# Altium project transmitter.PrjPcb
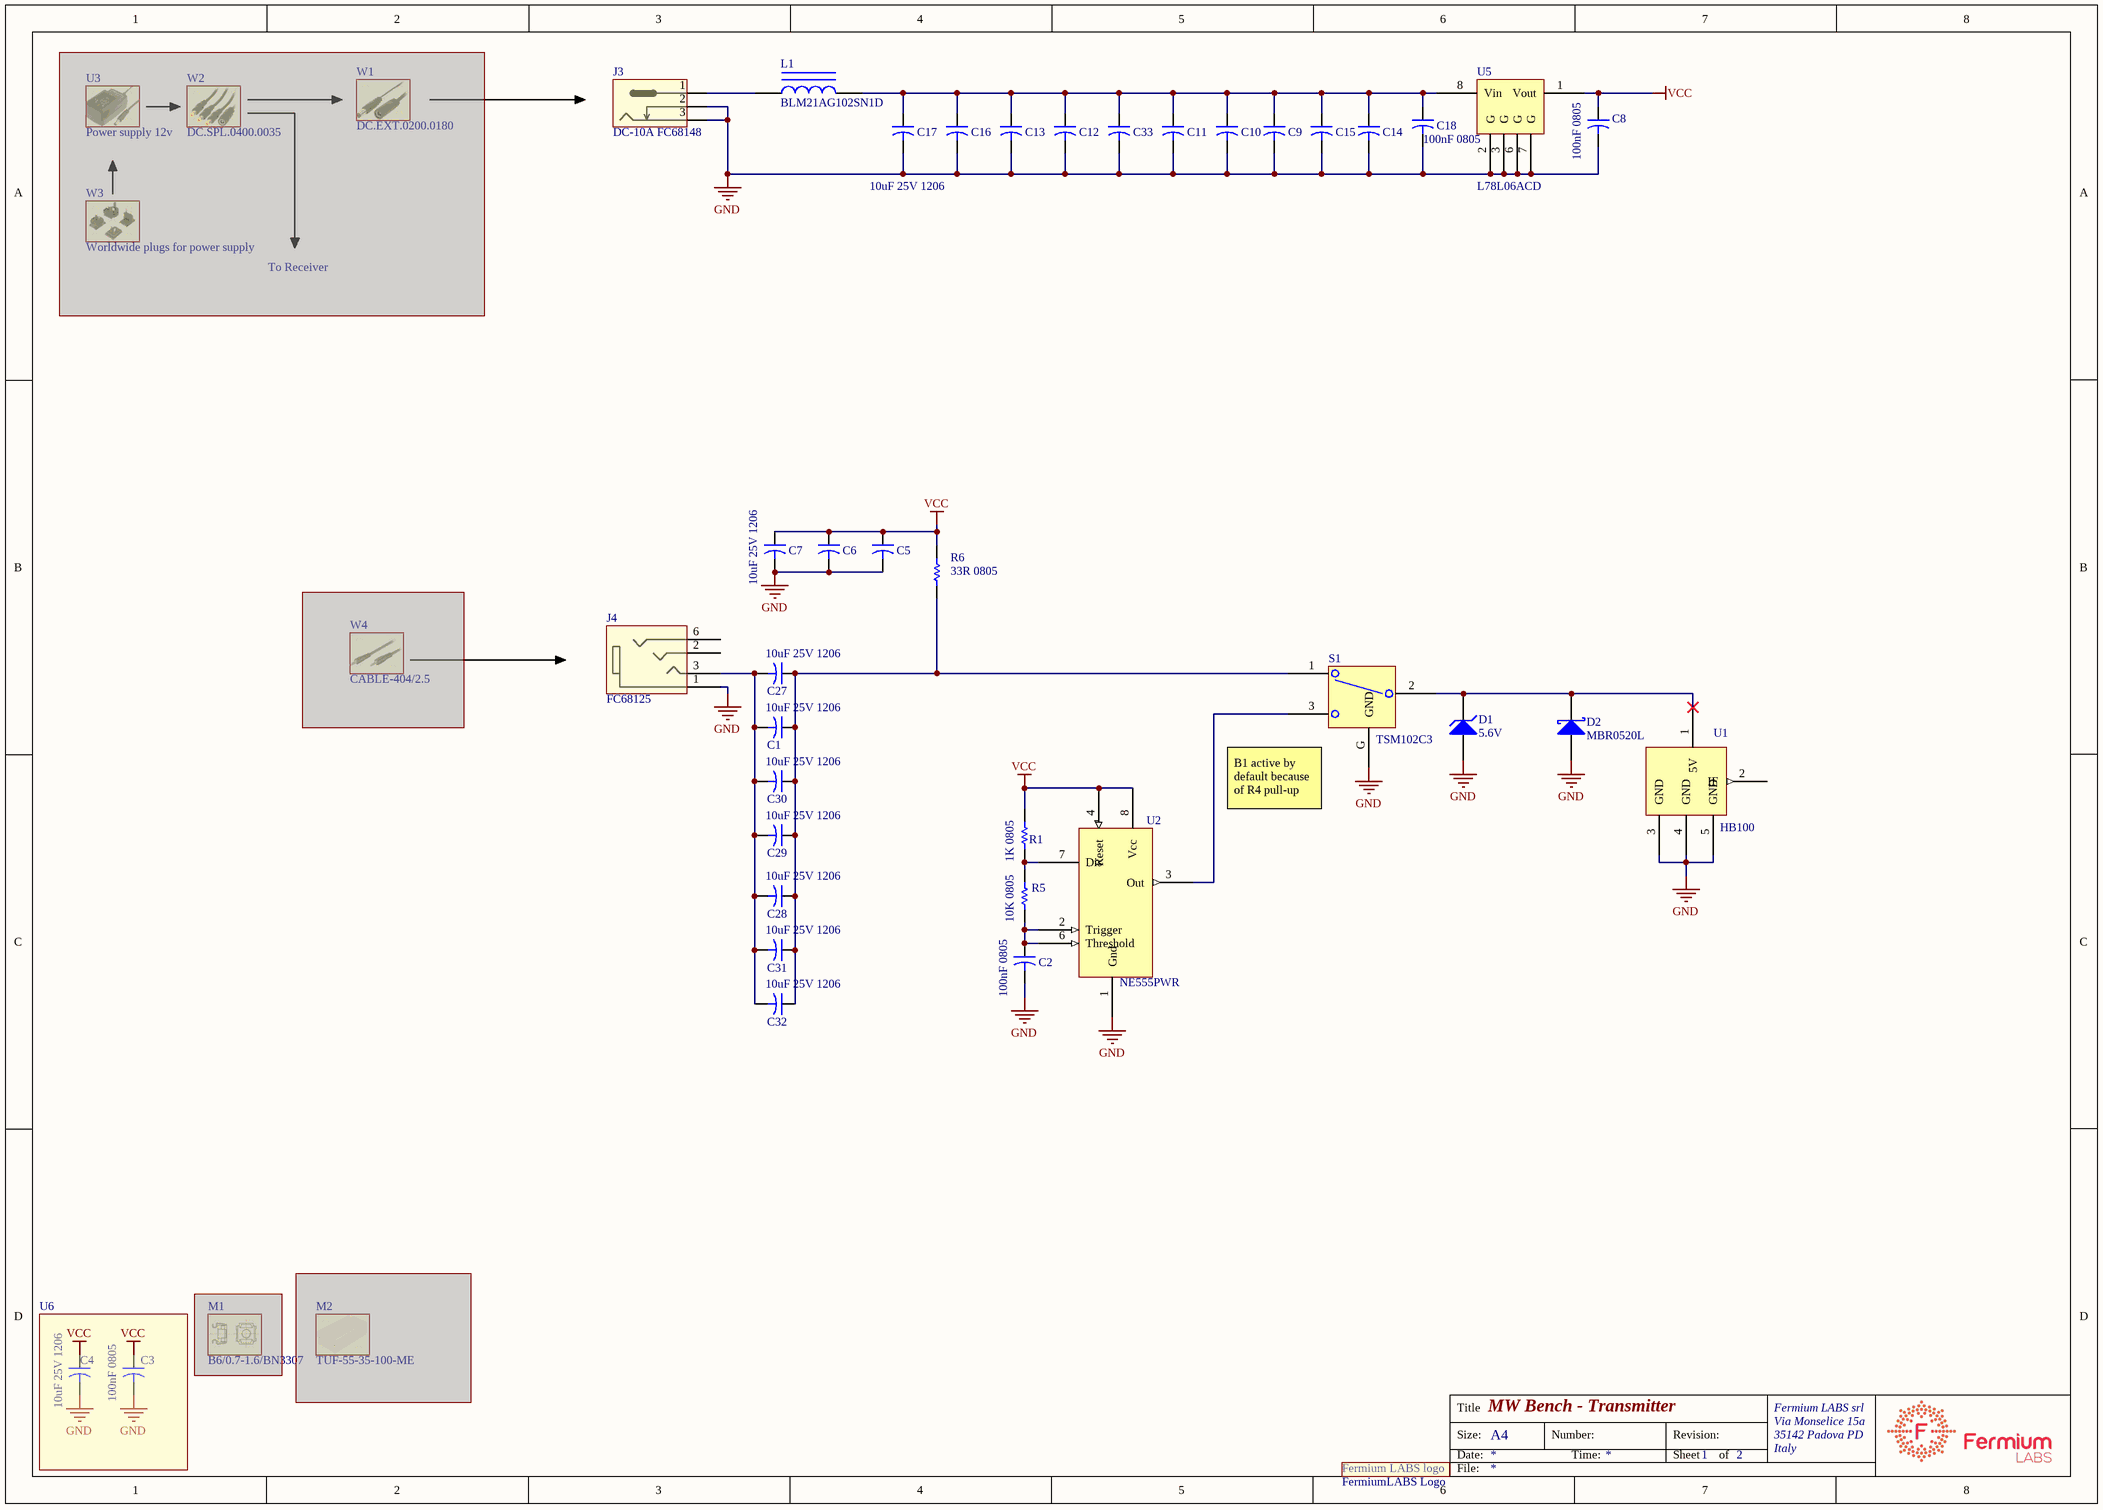
[diagram p0: transmitter.SchDoc]
1 sheet, 45 parts. Net scope: global (net labels, ports and power ports of the same name join across sheets).
Board file: transmitter.PcbDoc

## Sheet transmitter.SchDoc: MW Bench - Transmitter
size A3; Organization: Altium Limited; Address1: L3, 12a Rodborough Rd; Address2: Frenchs Forest; Address3: NSW; Address4: Australia 2086; SheetNumber: 1; SheetTotal: 2

### Parts
C1  10uF 25V 1206  [CAP 1206_3216]
C2  100nF 0805  [CAP 0805_2012]
C3  100nF 0805  [CAP 0805_2012]
C4  10uF 25V 1206  [CAP 1206_3216]
C5  10uF 25V 1206  [CAP 1206_3216]  (value not drawn)
C6  10uF 25V 1206  [CAP 1206_3216]  (value not drawn)
C7  10uF 25V 1206  [CAP 1206_3216]
C8  100nF 0805  [CAP 0805_2012]
C9  10uF 25V 1206  [CAP 1206_3216]  (value not drawn)
C10  10uF 25V 1206  [CAP 1206_3216]  (value not drawn)
C11  10uF 25V 1206  [CAP 1206_3216]  (value not drawn)
C12  10uF 25V 1206  [CAP 1206_3216]  (value not drawn)
C13  10uF 25V 1206  [CAP 1206_3216]  (value not drawn)
C14  10uF 25V 1206  [CAP 1206_3216]  (value not drawn)
C15  10uF 25V 1206  [CAP 1206_3216]  (value not drawn)
C16  10uF 25V 1206  [CAP 1206_3216]  (value not drawn)
C17  10uF 25V 1206  [CAP 1206_3216]
C18  100nF 0805  [CAP 0805_2012]
C27  10uF 25V 1206  [CAP 1206_3216]
C28  10uF 25V 1206  [CAP 1206_3216]
C29  10uF 25V 1206  [CAP 1206_3216]
C30  10uF 25V 1206  [CAP 1206_3216]
C31  10uF 25V 1206  [CAP 1206_3216]
C32  10uF 25V 1206  [CAP 1206_3216]
C33  10uF 25V 1206  [CAP 1206_3216]  (value not drawn)
D1  5.6V  [SOD123]
D2  MBR0520L  [SOD123]
J3  DC-10A FC68148  [dc-jack]  (no BOM)
J4  FC68125  [FC68125]
L1  BLM21AG102SN1D  [FER 0805_2012]
M1  B6/0.7-1.6/BN3307  (mechanical)  (masked out: inside a compile mask, not in the netlist)
M2  TUF-55-35-100-ME  (mechanical)  (masked out: inside a compile mask, not in the netlist)
R1  1K 0805  [RES 0805_2012]
R5  10K 0805  [RES 0805_2012]
R6  33R 0805  [RES 0805_2012]
S1  TSM102C3  [TSM102C3]
U1  HB100  [HB100-buried]
U2  NE555PWR  [TSSOP8]
U3  Power supply 12v  (mechanical)  (masked out: inside a compile mask, not in the netlist)
U5  L78L06ACD  [ST SOIC-8N]
W1  DC.EXT.0200.0180  (mechanical)  (masked out: inside a compile mask, not in the netlist)
W2  DC.SPL.0400.0035  (mechanical)  (masked out: inside a compile mask, not in the netlist)
W3  Worldwide plugs for power supply  (mechanical)  (masked out: inside a compile mask, not in the netlist)
W4  CABLE-404/2.5  (mechanical)  (masked out: inside a compile mask, not in the netlist)
XX2  FermiumLABS Logo  [frm-med]  (no BOM)

### Blocks framed on the sheet
U6: C3 C4

### Nets
GND: C2.2 C3.2 C4.2 C5.2 C6.2 C7.2 C8.2 C9.2 C10.2 C11.2 C12.2 C13.2 C14.2 C15.2 C16.2 C17.2 C18.2 C33.2 D1.A D2.A J3.2 J3.3 J4.1 S1.G(GND) U1.3(GND) U1.4(GND) U1.5(GND) U2.1(Gnd) U5.2(G) U5.3(G) U5.6(G) U5.7(G)
VCC: C3.1 C4.1 C5.1 C6.1 C7.1 C8.1 R1.2 R6.1 U2.4(Reset) U2.8(Vcc) U5.1(Vout)
NetC1_1: C1.1 C27.1 C28.1 C29.1 C30.1 C31.1 C32.1 R6.2 S1.1
NetC1_2: C1.2 C27.2 C28.2 C29.2 C30.2 C31.2 C32.2 J4.3
NetC2_1: C2.1 R5.1 U2.2(Trigger) U2.6(Threshold)
NetC9_1: C9.1 C10.1 C11.1 C12.1 C13.1 C14.1 C15.1 C16.1 C17.1 C18.1 C33.1 L1.2 U5.8(Vin)
NetD1_K: D1.K D2.K S1.2 U1.1(5V)
NetJ3_1: J3.1 L1.1
NetR1_1: R1.1 R5.2 U2.7(Dis)
NetS1_3: S1.3 U2.3(Out)

Not connected (* = marked no-connect by the designer): J4 2 6; U1 2(IF)

### Notes on the sheet
- To Receiver
- (near S1) B1 active by default because of R4 pull-up
- Title
- Size:
- Date:
- A4
- Number:
- Time:
- Revision:
- Sheet
- of
- Fermium LABS srl
- Via Monselice 15a
- 35142 Padova PD
- Italy
- File:
- (in symbol fermiumlabs-logo) Fermium LABS logo

### Library data of the parts
C1 C4-C7 C9-C17 C27-C33 = C10uF: Capacitor; Manufacturer: SAMSUNG; Manufacturer Part Number: CL31A106KAHNNNE; Part Number: C10uF
C2 C3 C8 C18 = C100nF: Capacitor; Manufacturer: YAGEO; Manufacturer Part Number: CC0805JRX7R9BB104; Part Number: C100nF
D1 = D Zener: Zener Diode; Manufacturer: Diodes; Manufacturer Part Number: BZT52C5V6-7-F; Part Number: D Zener
D2 = D Schottky: Schottky Diode; Manufacturer: FAIRCHILD SEMICONDUCTOR; Manufacturer Part Number: MBR0520L; Part Number: D Schottky
J3 = jackdc: Manufacturer: CLIFF; Manufacturer Part Number: DC-10A FC68148; Part Number: jackdc
J4 = FC68125: Manufacturer: CLIFF; Manufacturer Part Number: FC68125; Part Number: FC68125
L1 = Inductor Iron: Magnetic-Core Inductor; Manufacturer: Murata; Manufacturer Part Number: BLM21AG102SN1D; Part Number: Inductor Iron
R1 = R1K: Resistor; Manufacturer: Royal Electronic Factory; Manufacturer Part Number: 0805S8J0102T5E; Part Number: R1K
R5 = R10K: Resistor; Manufacturer: Royal Electronic Factory; Manufacturer Part Number: 0805S8J0103T5E; Part Number: R10K
R6 = R33: Resistor; Manufacturer: Vishay; Manufacturer Part Number: CRCW080533R0JNTABC; Part Number: R33
S1 = TSM102C3: Manufacturer Part Number: Ninigi; Manufacturer: TSM102C3; Part Number: TSM102C3
U1 = HB100: Manufacturer: China unspecified; Manufacturer Part Number: HB100; Part Number: HB100
U2 = NE555PWR: Manufacturer: Texas Instruments; Manufacturer Part Number: NE555PWR; Part Number: NE555PWR
U3 = GE12I12-P1J
U5 = L78L06ACD: Manufacturer: ST Microelectronics; Manufacturer Part Number: L78L06ACD; Part Number: L78L06ACD
W3 = GE-MIX
XX2 = fermiumlabs-logo: Part Number: fermiumlabs-logo